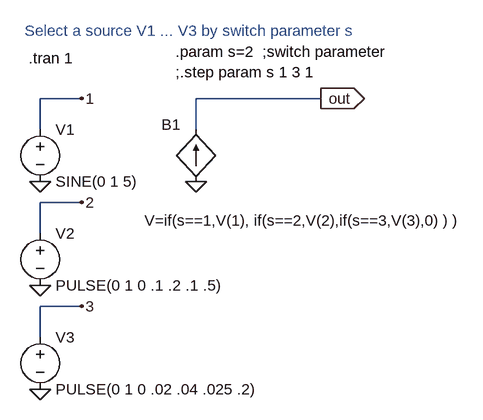
[diagram p0: schematic Select_Source_by_Param.asc]
Select_Source_by_Param.asc, the LTspice schematic file:
Version 4
SHEET 1 880 680
WIRE 176 176 176 128
WIRE 176 336 176 288
WIRE 176 496 176 448
WIRE 240 128 176 128
WIRE 240 288 176 288
WIRE 240 448 176 448
WIRE 416 176 416 128
WIRE 608 128 416 128
FLAG 416 256 0
FLAG 176 256 0
FLAG 240 128 1
FLAG 176 416 0
FLAG 240 288 2
FLAG 608 128 out
IOPIN 608 128 Out
FLAG 176 576 0
FLAG 240 448 3
SYMBOL bi 416 256 R180
WINDOW 0 24 88 Left 0
WINDOW 3 -410 -60 Left 0
SYMATTR InstName B1
SYMATTR Value V=if(s==1,V(1), if(s==2,V(2),if(s==3,V(3),0) ) )
SYMBOL voltage 176 160 R0
WINDOW 123 0 0 Left 0
WINDOW 39 0 0 Left 0
SYMATTR InstName V1
SYMATTR Value SINE(0 1 5)
SYMBOL voltage 176 320 R0
WINDOW 123 0 0 Left 0
WINDOW 39 0 0 Left 0
SYMATTR InstName V2
SYMATTR Value PULSE(0 1 0 .1 .2 .1 .5)
SYMBOL voltage 176 480 R0
WINDOW 123 0 0 Left 0
WINDOW 39 0 0 Left 0
SYMATTR InstName V3
SYMATTR Value PULSE(0 1 0 .02 .04 .025 .2)
TEXT 384 56 Left 0 !.param s=2  ;switch parameter\n;.step param s 1 3 1
TEXT 158 66 Left 0 !.tran 1
TEXT 152 24 Left 0 ;Select a source V1 ... V3 by switch parameter s

The netlist it stands for:
* Select_Source_by_Param.asc
B1 0 out V=if(s==1,V(1), if(s==2,V(2),if(s==3,V(3),0) ) )
V1 1 0 SINE(0 1 5)
V2 2 0 PULSE(0 1 0 .1 .2 .1 .5)
V3 3 0 PULSE(0 1 0 .02 .04 .025 .2)
.param s=2  ;switch parameter
;.step param s 1 3 1
.tran 1
* Select a source V1 ... V3 by switch parameter s
.backanno
.end